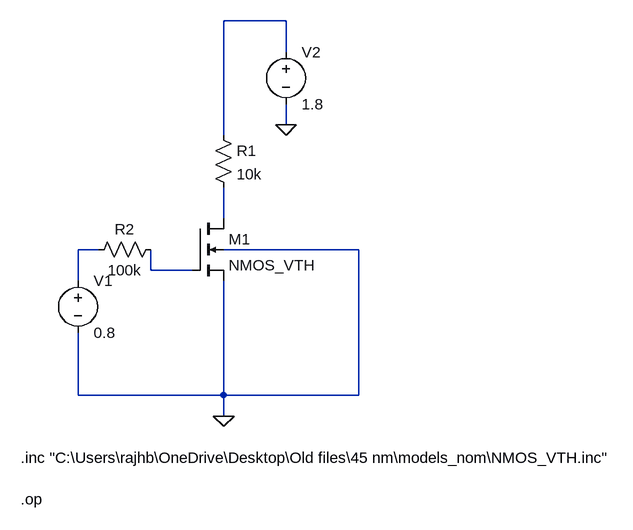
[diagram p0: schematic Exp6_CS.asc]
Exp6_CS.asc, the LTspice schematic file:
Version 4
SHEET 1 1356 680
WIRE 320 -192 224 -192
WIRE 320 -144 320 -192
WIRE 320 -32 320 -64
WIRE 224 -16 224 -192
WIRE 224 112 224 64
WIRE 32 160 0 160
WIRE 432 160 224 160
WIRE 112 192 112 160
WIRE 176 192 112 192
WIRE 0 208 0 160
WIRE 0 384 0 288
WIRE 224 384 224 208
WIRE 224 384 0 384
WIRE 432 384 432 160
WIRE 432 384 224 384
WIRE 224 416 224 384
FLAG 320 -32 0
FLAG 224 416 0
SYMBOL nmos4 176 112 R0
SYMATTR InstName M1
SYMATTR Value NMOS_VTH
SYMATTR Value2 l=100n w=1u
SYMBOL voltage 0 192 R0
WINDOW 123 0 0 Left 0
WINDOW 39 0 0 Left 0
SYMATTR InstName V1
SYMATTR Value 0.8
SYMBOL voltage 320 -160 R0
WINDOW 123 0 0 Left 0
WINDOW 39 0 0 Left 0
SYMATTR InstName V2
SYMATTR Value 1.8
SYMBOL res 208 -32 R0
SYMATTR InstName R1
SYMATTR Value 10k
SYMBOL res 128 144 R90
WINDOW 0 0 56 VBottom 2
WINDOW 3 32 56 VTop 2
SYMATTR InstName R2
SYMATTR Value 100k
TEXT -88 480 Left 2 !.inc "C:\\Users\\rajhb\\OneDrive\\Desktop\\Old files\\45 nm\\models_nom\\NMOS_VTH.inc"
TEXT -88 544 Left 2 !.op

The netlist it stands for:
* Exp6_CS.asc
M1 N002 N004 0 0 NMOS_VTH l=100n w=1u
V1 N003 0 0.8
V2 N001 0 1.8
R1 N001 N002 10k
R2 N004 N003 100k
.model NMOS NMOS
.model PMOS PMOS
.lib standard.mos
.inc "C:\Users\rajhb\OneDrive\Desktop\Old files\45 nm\models_nom\NMOS_VTH.inc"
.op
.backanno
.end